# EAGLE schematic omni-usb_1.00a (EAGLE 6.6.0)

## Sheet 1 of 3
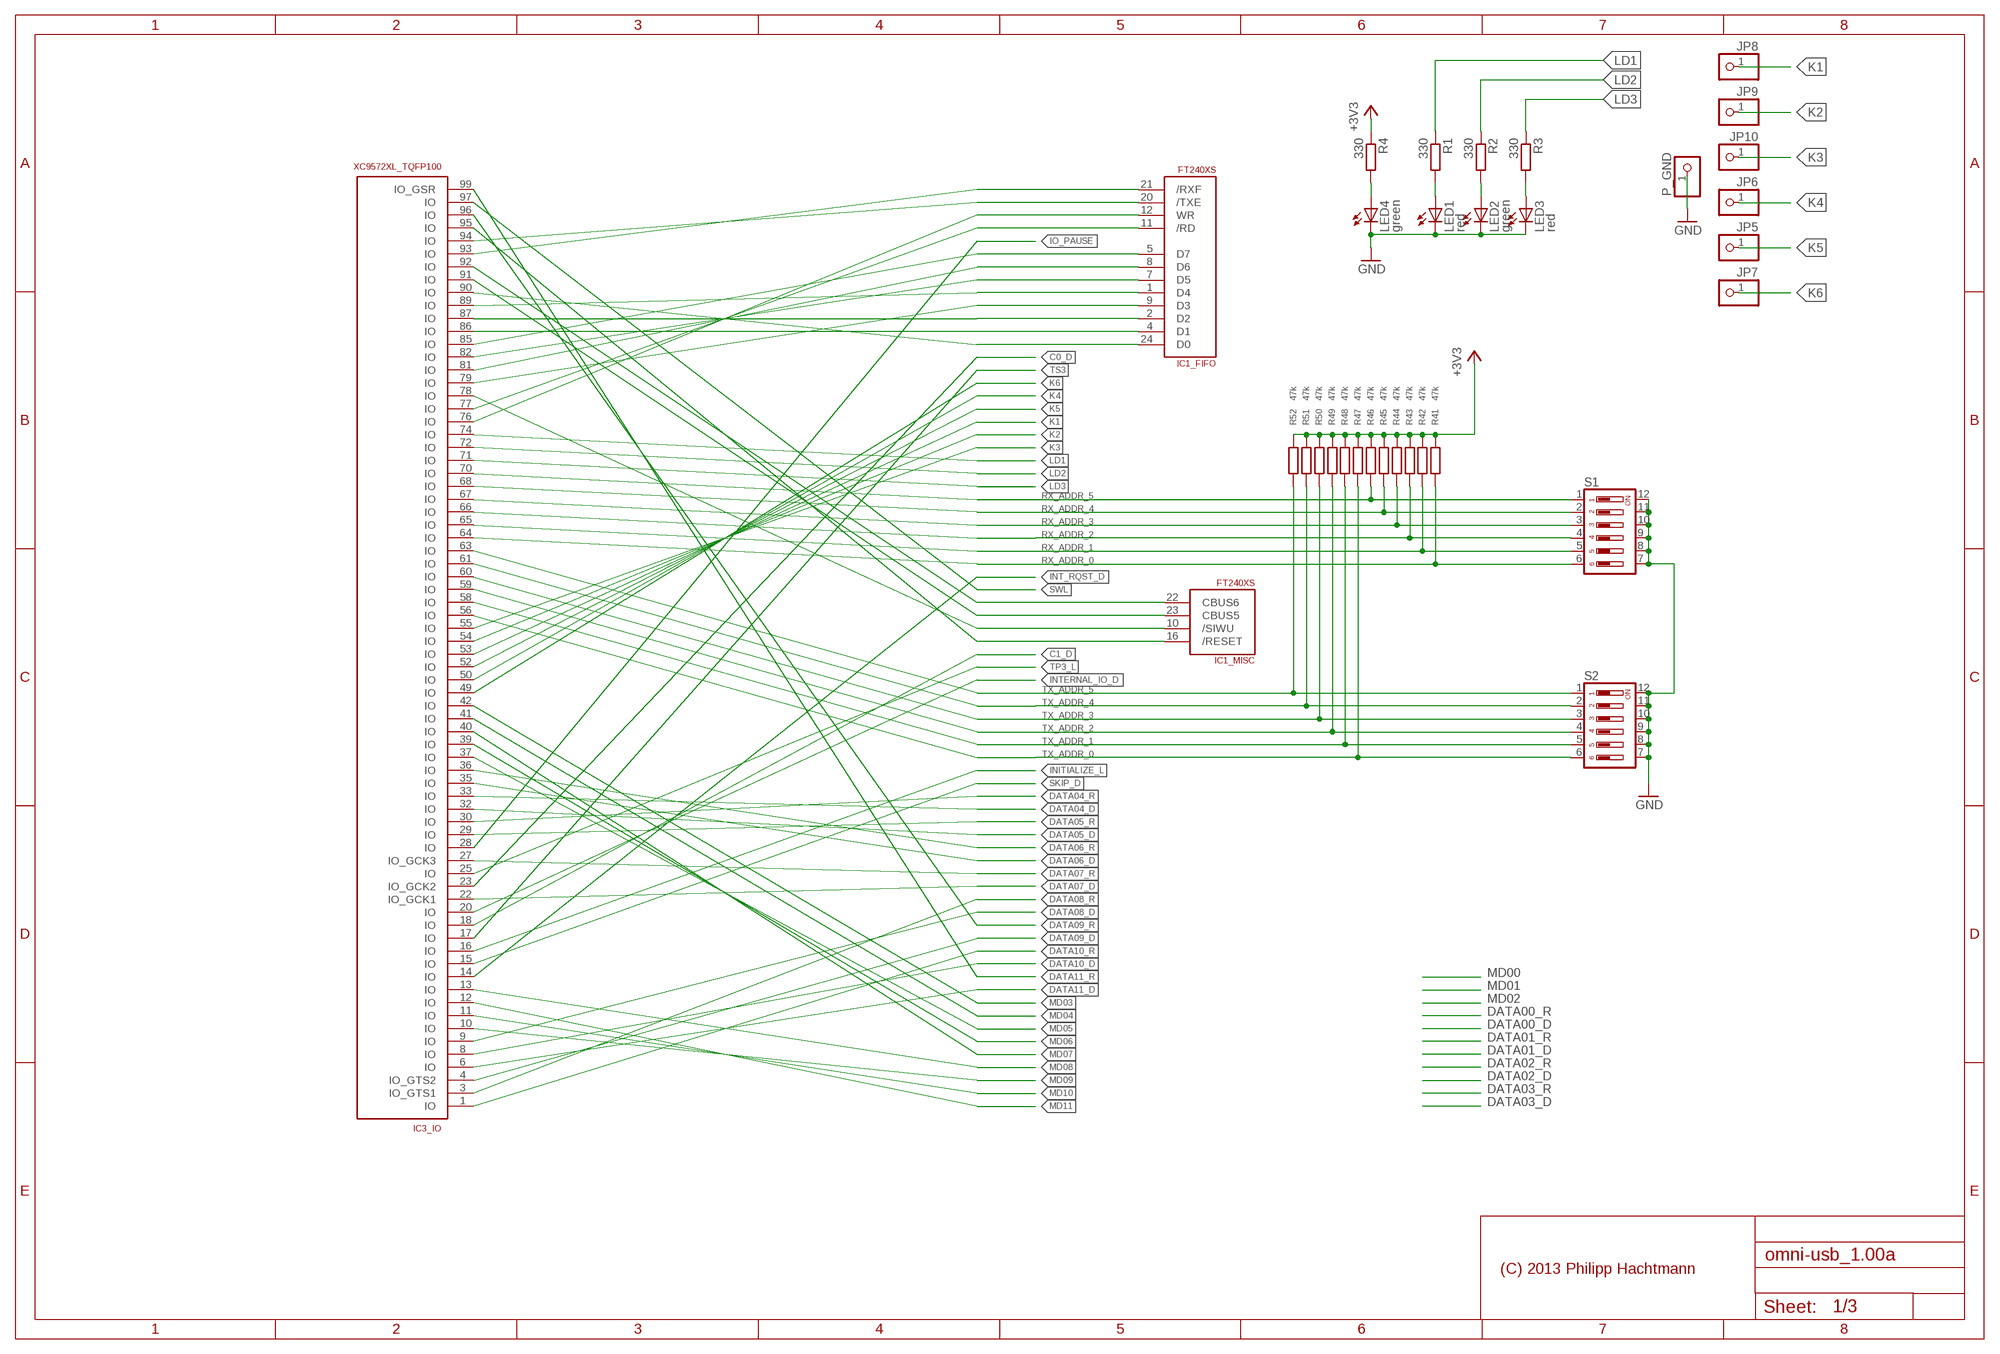
[diagram p0: schematic, sheet 1]

### Parts
IC1  FT240XS  [TSSOP24]
IC3  XC9572XL_TQFP100  [TQ100]
JP5  PINHD-1X1  [1X01]
JP6  PINHD-1X1  [1X01]
JP7  PINHD-1X1  [1X01]
JP8  PINHD-1X1  [1X01]
JP9  PINHD-1X1  [1X01]
JP10  PINHD-1X1  [1X01]
LED1  red  LEDCHIPLED_0805  [CHIPLED_0805]
LED2  green  LEDCHIPLED_0805  [CHIPLED_0805]
LED3  red  LEDCHIPLED_0805  [CHIPLED_0805]
LED4  green  LEDCHIPLED_0805  [CHIPLED_0805]
P_GND  PINHD-1X1  [1X01]
R1  330  R-EU_R0805  [R0805]
R2  330  R-EU_R0805  [R0805]
R3  330  R-EU_R0805  [R0805]
R4  330  R-EU_R0805  [R0805]
R41  47k  R-EU_R0805  [R0805]
R42  47k  R-EU_R0805  [R0805]
R43  47k  R-EU_R0805  [R0805]
R44  47k  R-EU_R0805  [R0805]
R45  47k  R-EU_R0805  [R0805]
R46  47k  R-EU_R0805  [R0805]
R47  47k  R-EU_R0805  [R0805]
R48  47k  R-EU_R0805  [R0805]
R49  47k  R-EU_R0805  [R0805]
R50  47k  R-EU_R0805  [R0805]
R51  47k  R-EU_R0805  [R0805]
R52  47k  R-EU_R0805  [R0805]
S1  DIP06YL  [DIP06YL]
S2  DIP06YL  [DIP06YL]

### Nets
!RD: IC1.11(_FIFO:/RD) IC3.77(_IO:IO)
!RESET: IC1.16(_MISC:/RESET) IC3.95(_IO:IO)
!RXF: IC1.21(_FIFO:/RXF) IC3.93(_IO:IO)
!TXE: IC1.20(_FIFO:/TXE) IC3.94(_IO:IO)
+3V3: R4.1 R41.2 R42.2 R43.2 R44.2 R45.2 R46.2 R47.2 R48.2 R49.2 R50.2 R51.2 R52.2 ; also sheet 3
/SIWU: IC1.10(_MISC:/SIWU) IC3.78(_IO:IO)
C0_D: IC3.23(_IO:IO_GCK2) ; also sheet 2
C1_D: IC3.18(_IO:IO) ; also sheet 2
CBUS5: IC1.23(_MISC:CBUS5) IC3.91(_IO:IO)
CBUS6: IC1.22(_MISC:CBUS6) IC3.92(_IO:IO)
D0: IC1.24(_FIFO:D0) IC3.90(_IO:IO)
D1: IC1.4(_FIFO:D1) IC3.86(_IO:IO)
D2: IC1.2(_FIFO:D2) IC3.87(_IO:IO)
D3: IC1.9(_FIFO:D3) IC3.79(_IO:IO)
D4: IC1.1(_FIFO:D4) IC3.89(_IO:IO)
D5: IC1.7(_FIFO:D5) IC3.82(_IO:IO)
D6: IC1.8(_FIFO:D6) IC3.81(_IO:IO)
D7: IC1.5(_FIFO:D7) IC3.85(_IO:IO)
DATA04_D: IC3.33(_IO:IO) ; also sheet 2
DATA04_R: IC3.30(_IO:IO) ; also sheet 2,3
DATA05_D: IC3.32(_IO:IO) ; also sheet 2
DATA05_R: IC3.29(_IO:IO) ; also sheet 2,3
DATA06_D: IC3.35(_IO:IO) ; also sheet 2
DATA06_R: IC3.36(_IO:IO) ; also sheet 2,3
DATA07_D: IC3.22(_IO:IO_GCK1) ; also sheet 2
DATA07_R: IC3.27(_IO:IO_GCK3) ; also sheet 2,3
DATA08_D: IC3.9(_IO:IO) ; also sheet 2
DATA08_R: IC3.3(_IO:IO_GTS1) ; also sheet 2,3
DATA09_D: IC3.4(_IO:IO_GTS2) ; also sheet 2
DATA09_R: IC3.96(_IO:IO) ; also sheet 2,3
DATA10_D: IC3.8(_IO:IO) ; also sheet 2
DATA10_R: IC3.1(_IO:IO) ; also sheet 2,3
DATA11_D: IC3.6(_IO:IO) ; also sheet 2
DATA11_R: IC3.99(_IO:IO_GSR) ; also sheet 2,3
GND: LED1.C LED2.C LED3.C LED4.C P_GND.1 S1.7 S1.8 S1.9 S1.10 S1.11 S1.12 S2.7 S2.8 S2.9 S2.10 S2.11 S2.12 ; also sheet 3
INITIALIZE_L: IC3.16(_IO:IO) ; also sheet 2,3
INT_RQST_D: IC3.14(_IO:IO) ; also sheet 2
INTERNAL_IO_D: IC3.20(_IO:IO) ; also sheet 2
IO_PAUSE: IC3.28(_IO:IO) ; also sheet 2,3
K1: IC3.53(_IO:IO) JP8.1
K2: IC3.54(_IO:IO) JP9.1
K3: IC3.55(_IO:IO) JP10.1
K4: IC3.50(_IO:IO) JP6.1
K5: IC3.52(_IO:IO) JP5.1
K6: IC3.49(_IO:IO) JP7.1
LD1: IC3.74(_IO:IO) R1.1
LD2: IC3.72(_IO:IO) R2.1
LD3: IC3.71(_IO:IO) R3.1
LED3: LED2.A R2.2
MD03: IC3.42(_IO:IO) ; also sheet 2,3
MD04: IC3.41(_IO:IO) ; also sheet 2,3
MD05: IC3.37(_IO:IO) ; also sheet 2,3
MD06: IC3.39(_IO:IO) ; also sheet 2,3
MD07: IC3.40(_IO:IO) ; also sheet 2,3
MD08: IC3.13(_IO:IO) ; also sheet 2,3
MD09: IC3.10(_IO:IO) ; also sheet 2,3
MD10: IC3.11(_IO:IO) ; also sheet 2,3
MD11: IC3.12(_IO:IO) ; also sheet 2,3
N$7: IC1.12(_FIFO:WR) IC3.76(_IO:IO)
N$21: LED1.A R1.2
N$33: LED4.A R4.2
N$37: LED3.A R3.2
RX_ADDR_0: IC3.64(_IO:IO) R41.1 S1.6
RX_ADDR_1: IC3.65(_IO:IO) R42.1 S1.5
RX_ADDR_2: IC3.66(_IO:IO) R43.1 S1.4
RX_ADDR_3: IC3.67(_IO:IO) R44.1 S1.3
RX_ADDR_4: IC3.68(_IO:IO) R45.1 S1.2
RX_ADDR_5: IC3.70(_IO:IO) R46.1 S1.1
SKIP_D: IC3.15(_IO:IO) ; also sheet 2
SWL: IC3.97(_IO:IO) ; also sheet 2,3
TP3_L: IC3.25(_IO:IO) ; also sheet 2,3
TS3: IC3.17(_IO:IO) ; also sheet 2,3
TX_ADDR_0: IC3.56(_IO:IO) R47.1 S2.6
TX_ADDR_1: IC3.58(_IO:IO) R48.1 S2.5
TX_ADDR_2: IC3.59(_IO:IO) R49.1 S2.4
TX_ADDR_3: IC3.60(_IO:IO) R50.1 S2.3
TX_ADDR_4: IC3.61(_IO:IO) R51.1 S2.2
TX_ADDR_5: IC3.63(_IO:IO) R52.1 S2.1
Unconnected: IC3.2(_NC:NC) IC3.7(_NC:NC) IC3.19(_NC:NC) IC3.24(_NC:NC) IC3.34(_NC:NC) IC3.43(_NC:NC) IC3.46(_NC:NC) IC3.73(_NC:NC) IC3.80(_NC:NC)

## Sheet 2 of 3
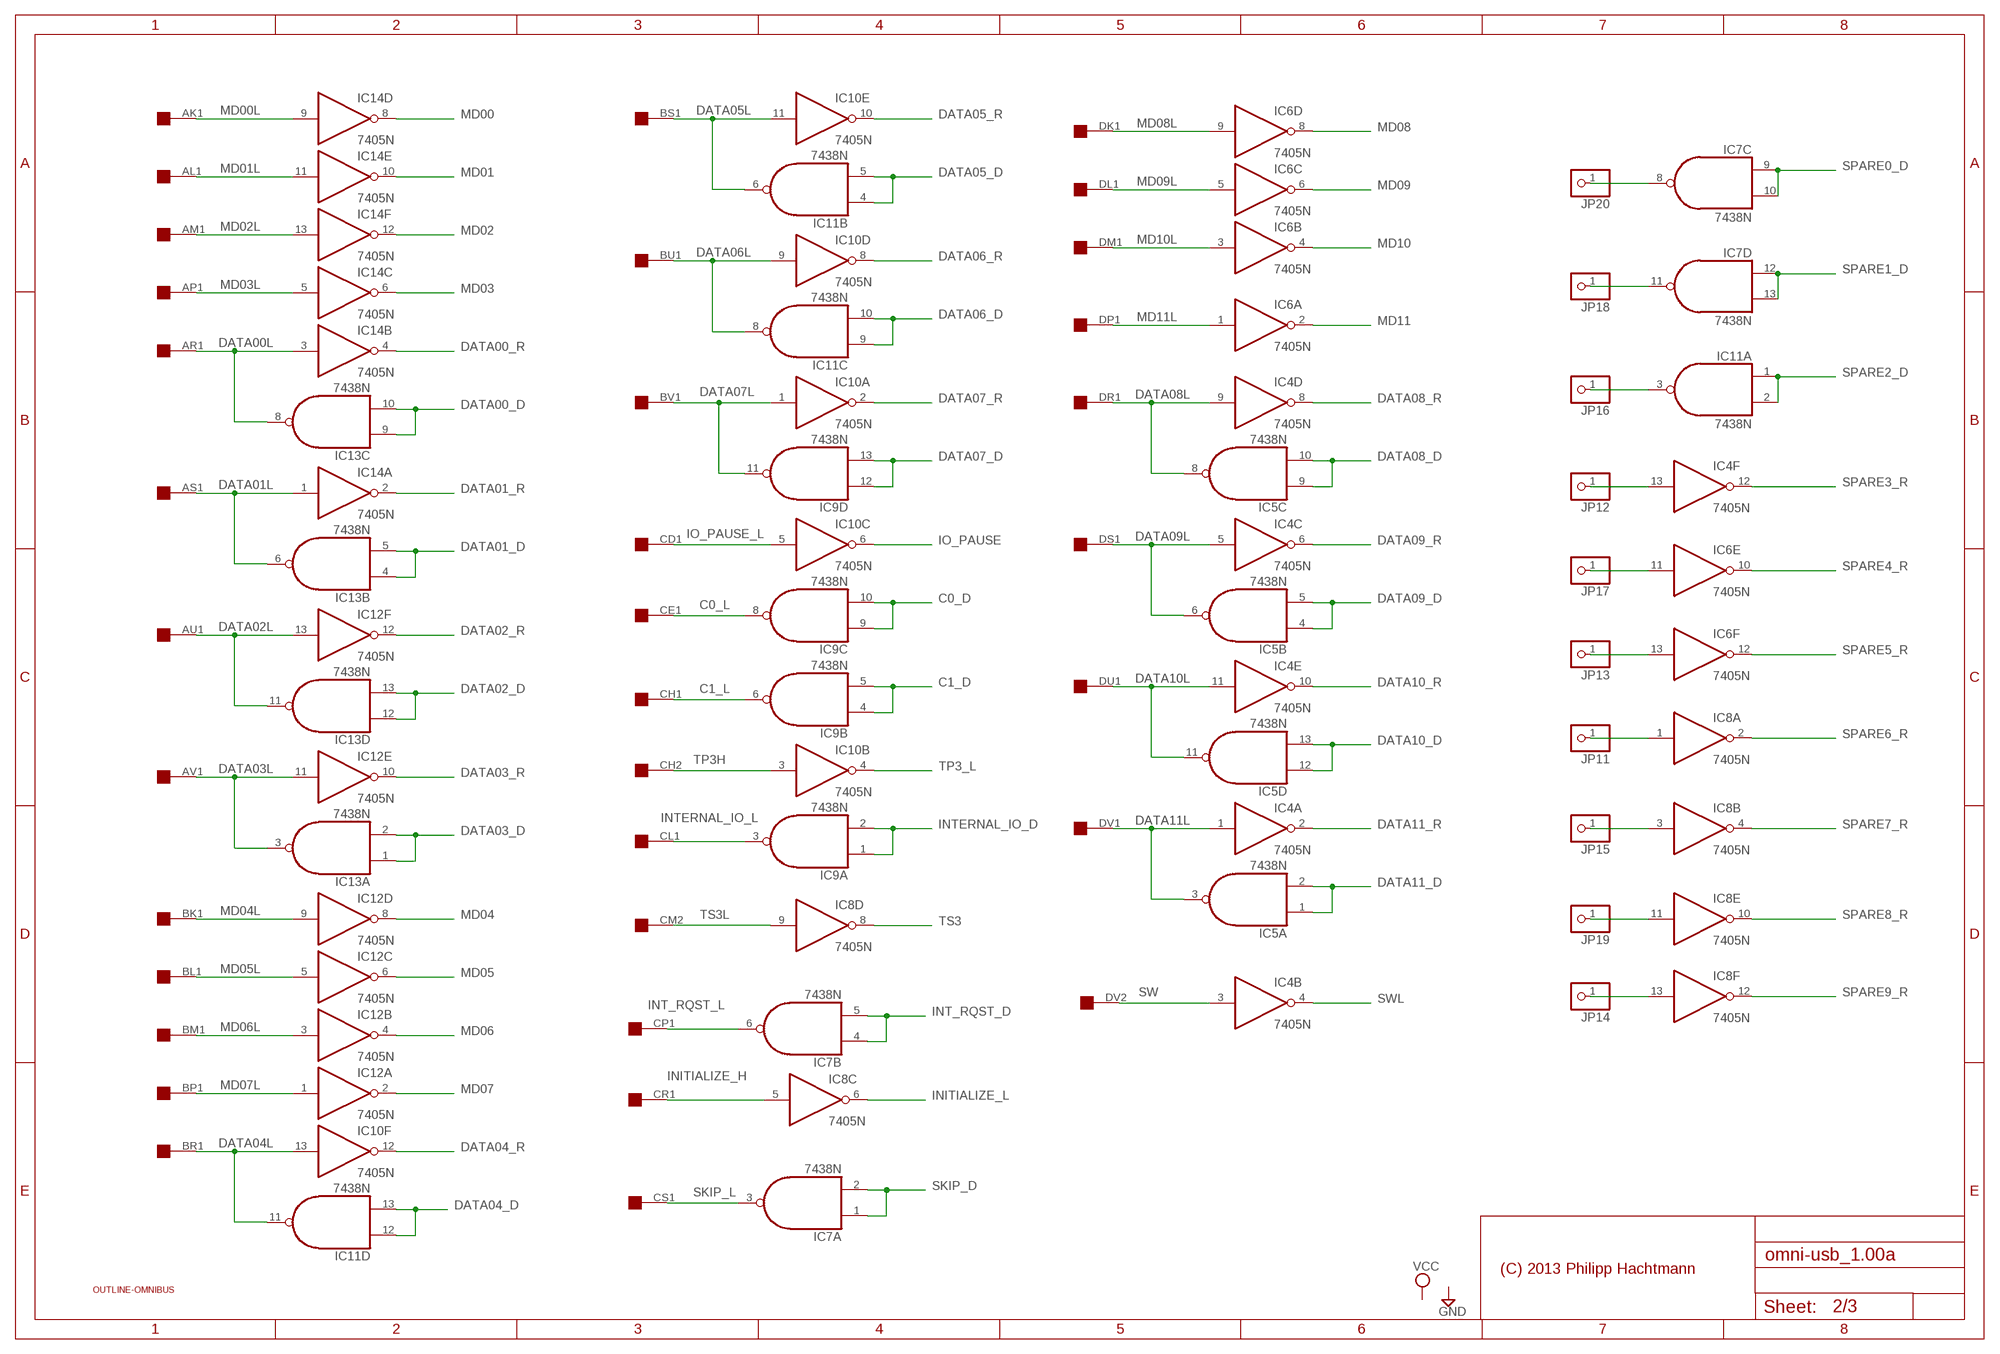
[diagram p1: schematic, sheet 2]

### Parts
IC4  7405N  [DIL14]
IC5  7438N  [DIL14]
IC6  7405N  [DIL14]
IC7  7438N  [DIL14]
IC8  7405N  [DIL14]
IC9  7438N  [DIL14]
IC10  7405N  [DIL14]
IC11  7438N  [DIL14]
IC12  7405N  [DIL14]
IC13  7438N  [DIL14]
IC14  7405N  [DIL14]
JP11  PINHD-1X1  [1X01]
JP12  PINHD-1X1  [1X01]
JP13  PINHD-1X1  [1X01]
JP14  PINHD-1X1  [1X01]
JP15  PINHD-1X1  [1X01]
JP16  PINHD-1X1  [1X01]
JP17  PINHD-1X1  [1X01]
JP18  PINHD-1X1  [1X01]
JP19  PINHD-1X1  [1X01]
JP20  PINHD-1X1  [1X01]
U$1  OUTLINE-OMNIBUS  [OMNIBUS]
U$2  QUAD  [EDGE-CON8]

### Nets
C0_D: IC9.9(C:I0) IC9.10(C:I1) ; also sheet 1
C0_L: IC9.8(C:O) U$2.CE1
C1_D: IC9.4(B:I0) IC9.5(B:I1) ; also sheet 1
C1_L: IC9.6(B:O) U$2.CH1
DATA00_D: IC13.9(C:I0) IC13.10(C:I1) ; also sheet 1
DATA00_R: IC14.4(B:O) ; also sheet 1,3
DATA00L: IC13.8(C:O) IC14.3(B:I) U$2.AR1
DATA01_D: IC13.4(B:I0) IC13.5(B:I1) ; also sheet 1
DATA01_R: IC14.2(A:O) ; also sheet 1,3
DATA01L: IC13.6(B:O) IC14.1(A:I) U$2.AS1
DATA02_D: IC13.12(D:I0) IC13.13(D:I1) ; also sheet 1
DATA02_R: IC12.12(F:O) ; also sheet 1,3
DATA02L: IC12.13(F:I) IC13.11(D:O) U$2.AU1
DATA03_D: IC13.1(A:I0) IC13.2(A:I1) ; also sheet 1
DATA03_R: IC12.10(E:O) ; also sheet 1,3
DATA03L: IC12.11(E:I) IC13.3(A:O) U$2.AV1
DATA04_D: IC11.12(D:I0) IC11.13(D:I1) ; also sheet 1
DATA04_R: IC10.12(F:O) ; also sheet 1,3
DATA04L: IC10.13(F:I) IC11.11(D:O) U$2.BR1
DATA05_D: IC11.4(B:I0) IC11.5(B:I1) ; also sheet 1
DATA05_R: IC10.10(E:O) ; also sheet 1,3
DATA05L: IC10.11(E:I) IC11.6(B:O) U$2.BS1
DATA06_D: IC11.9(C:I0) IC11.10(C:I1) ; also sheet 1
DATA06_R: IC10.8(D:O) ; also sheet 1,3
DATA06L: IC10.9(D:I) IC11.8(C:O) U$2.BU1
DATA07_D: IC9.12(D:I0) IC9.13(D:I1) ; also sheet 1
DATA07_R: IC10.2(A:O) ; also sheet 1,3
DATA07L: IC9.11(D:O) IC10.1(A:I) U$2.BV1
DATA08_D: IC5.9(C:I0) IC5.10(C:I1) ; also sheet 1
DATA08_R: IC4.8(D:O) ; also sheet 1,3
DATA08L: IC4.9(D:I) IC5.8(C:O) U$2.DR1
DATA09_D: IC5.4(B:I0) IC5.5(B:I1) ; also sheet 1
DATA09_R: IC4.6(C:O) ; also sheet 1,3
DATA09L: IC4.5(C:I) IC5.6(B:O) U$2.DS1
DATA10_D: IC5.12(D:I0) IC5.13(D:I1) ; also sheet 1
DATA10_R: IC4.10(E:O) ; also sheet 1,3
DATA10L: IC4.11(E:I) IC5.11(D:O) U$2.DU1
DATA11_D: IC5.1(A:I0) IC5.2(A:I1) ; also sheet 1
DATA11_R: IC4.2(A:O) ; also sheet 1,3
DATA11L: IC4.1(A:I) IC5.3(A:O) U$2.DV1
INITIALIZE_H: IC8.5(C:I) U$2.CR1
INITIALIZE_L: IC8.6(C:O) ; also sheet 1,3
INT_RQST_D: IC7.4(B:I0) IC7.5(B:I1) ; also sheet 1
INT_RQST_L: IC7.6(B:O) U$2.CP1
INTERNAL_IO_D: IC9.1(A:I0) IC9.2(A:I1) ; also sheet 1
INTERNAL_IO_L: IC9.3(A:O) U$2.CL1
IO_PAUSE: IC10.6(C:O) ; also sheet 1,3
IO_PAUSE_L: IC10.5(C:I) U$2.CD1
MD00: IC14.8(D:O) ; also sheet 1,3
MD00L: IC14.9(D:I) U$2.AK1
MD01: IC14.10(E:O) ; also sheet 1,3
MD01L: IC14.11(E:I) U$2.AL1
MD02: IC14.12(F:O) ; also sheet 1,3
MD02L: IC14.13(F:I) U$2.AM1
MD03: IC14.6(C:O) ; also sheet 1,3
MD03L: IC14.5(C:I) U$2.AP1
MD04: IC12.8(D:O) ; also sheet 1,3
MD04L: IC12.9(D:I) U$2.BK1
MD05: IC12.6(C:O) ; also sheet 1,3
MD05L: IC12.5(C:I) U$2.BL1
MD06: IC12.4(B:O) ; also sheet 1,3
MD06L: IC12.3(B:I) U$2.BM1
MD07: IC12.2(A:O) ; also sheet 1,3
MD07L: IC12.1(A:I) U$2.BP1
MD08: IC6.8(D:O) ; also sheet 1,3
MD08L: IC6.9(D:I) U$2.DK1
MD09: IC6.6(C:O) ; also sheet 1,3
MD09L: IC6.5(C:I) U$2.DL1
MD10: IC6.4(B:O) ; also sheet 1,3
MD10L: IC6.3(B:I) U$2.DM1
MD11: IC6.2(A:O) ; also sheet 1,3
MD11L: IC6.1(A:I) U$2.DP1
N$1: IC7.8(C:O) JP20.1
N$10: IC7.11(D:O) JP18.1
N$11: IC11.3(A:O) JP16.1
N$13: IC4.13(F:I) JP12.1
N$14: IC6.11(E:I) JP17.1
N$15: IC6.13(F:I) JP13.1
N$18: IC8.1(A:I) JP11.1
N$19: IC8.3(B:I) JP15.1
N$20: IC8.11(E:I) JP19.1
N$22: IC8.13(F:I) JP14.1
SKIP_D: IC7.1(A:I0) IC7.2(A:I1) ; also sheet 1
SKIP_L: IC7.3(A:O) U$2.CS1
SPARE0_D: IC7.9(C:I0) IC7.10(C:I1)
SPARE1_D: IC7.12(D:I0) IC7.13(D:I1)
SPARE2_D: IC11.1(A:I0) IC11.2(A:I1)
SPARE3_R: IC4.12(F:O) ; also sheet 3
SPARE4_R: IC6.10(E:O) ; also sheet 3
SPARE5_R: IC6.12(F:O) ; also sheet 3
SPARE6_R: IC8.2(A:O) ; also sheet 3
SPARE7_R: IC8.4(B:O) ; also sheet 3
SPARE8_R: IC8.10(E:O) ; also sheet 3
SPARE9_R: IC8.12(F:O) ; also sheet 3
SW: IC4.3(B:I) U$2.DV2
SWL: IC4.4(B:O) ; also sheet 1,3
TP3_L: IC10.4(B:O) ; also sheet 1,3
TP3H: IC10.3(B:I) U$2.CH2
TS3: IC8.8(D:O) ; also sheet 1,3
TS3L: IC8.9(D:I) U$2.CM2
Unconnected: U$2.AA1 U$2.AB1 U$2.AB2 U$2.AC1 U$2.AD1 U$2.AD2 U$2.AE1 U$2.AE2 U$2.AH1 U$2.AH2 U$2.AJ1 U$2.AJ2 U$2.AK2 U$2.AL2 U$2.AM2 U$2.AP2 U$2.AR2 U$2.AS2 U$2.AU2 U$2.AV2 U$2.BA1 U$2.BB1 U$2.BB2 U$2.BD1 U$2.BD2 U$2.BE1 U$2.BE2 U$2.BH1 U$2.BH2 U$2.BJ1 U$2.BJ2 U$2.BK2 U$2.BL2 U$2.BM2 U$2.BP2 U$2.BR2 U$2.BS2 U$2.BU2 U$2.BV2 U$2.CA1 U$2.CB1 U$2.CB2 U$2.CD2 U$2.CE2 U$2.CJ1 U$2.CJ2 U$2.CK1 U$2.CK2 U$2.CL2 U$2.CM1 U$2.CP2 U$2.CR2 U$2.CS2 U$2.CU1 U$2.CU2 U$2.CV1 U$2.CV2 U$2.DA1 U$2.DA2 U$2.DB1 U$2.DB2 U$2.DD1 U$2.DD2 U$2.DE1 U$2.DE2 U$2.DH1 U$2.DH2 U$2.DJ1 U$2.DJ2 U$2.DK2 U$2.DL2 U$2.DM2 U$2.DP2 U$2.DR2 U$2.DS2 U$2.DU2

## Sheet 3 of 3
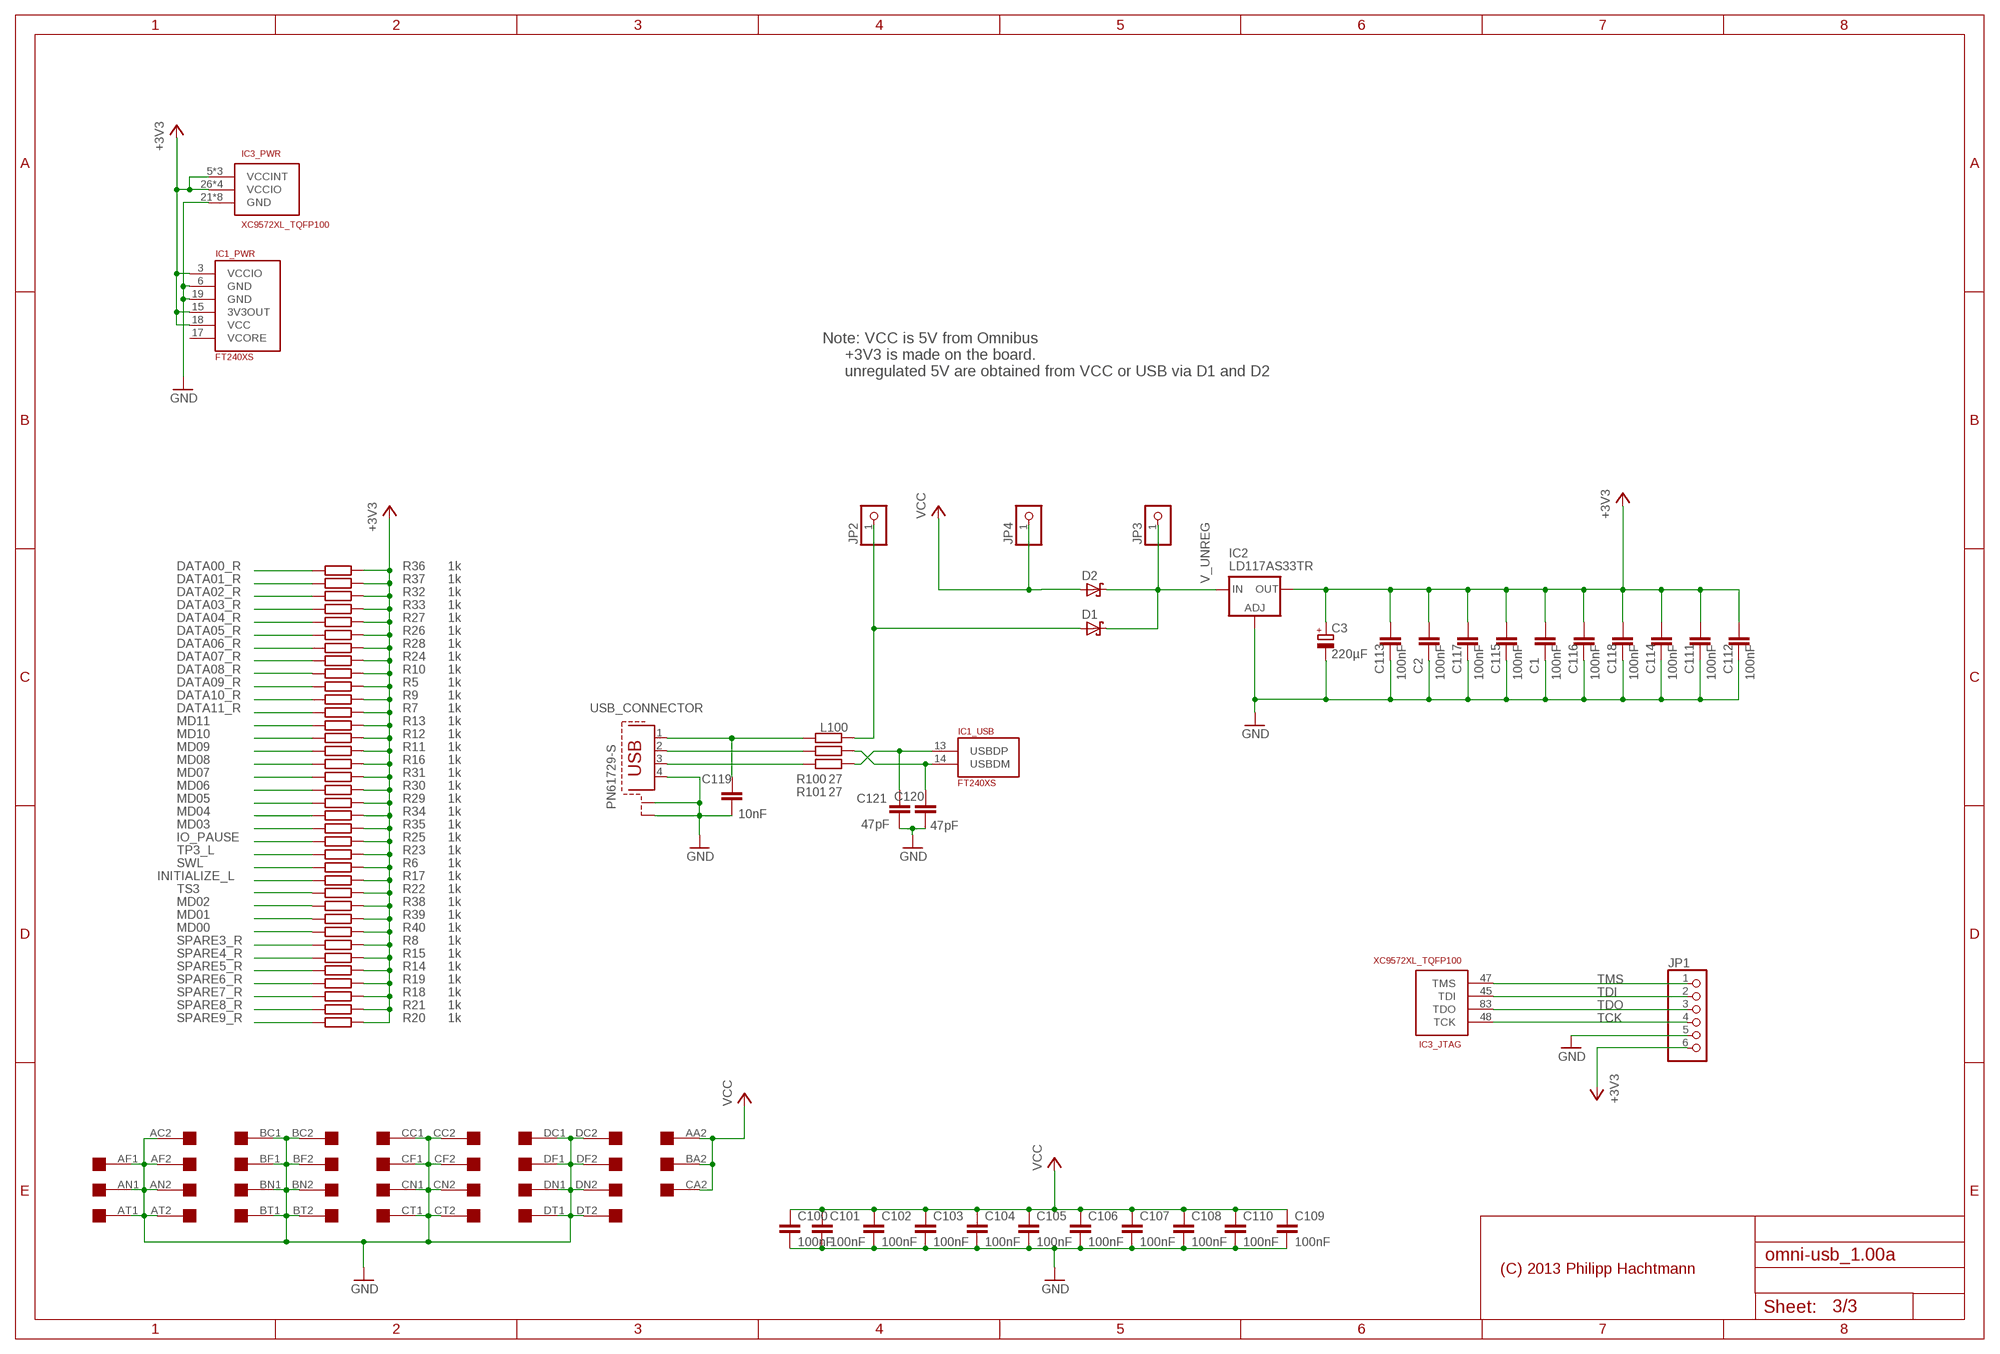
[diagram p2: schematic, sheet 3]

### Parts
C1  100nF  C-EUC0805  [C0805]
C2  100nF  C-EUC0805  [C0805]
C3  220µF  CPOL-EUSANYO_SMD_F8  [SANYO-OSCON_SMD_F8]
C100  100nF  C-EUC0805  [C0805]
C101  100nF  C-EUC0805  [C0805]
C102  100nF  C-EUC0805  [C0805]
C103  100nF  C-EUC0805  [C0805]
C104  100nF  C-EUC0805  [C0805]
C105  100nF  C-EUC0805  [C0805]
C106  100nF  C-EUC0805  [C0805]
C107  100nF  C-EUC0805  [C0805]
C108  100nF  C-EUC0805  [C0805]
C109  100nF  C-EUC0805  [C0805]
C110  100nF  C-EUC0805  [C0805]
C111  100nF  C-EUC0805  [C0805]
C112  100nF  C-EUC0805  [C0805]
C113  100nF  C-EUC0805  [C0805]
C114  100nF  C-EUC0805  [C0805]
C115  100nF  C-EUC0805  [C0805]
C116  100nF  C-EUC0805  [C0805]
C117  100nF  C-EUC0805  [C0805]
C118  100nF  C-EUC0805  [C0805]
C119  10nF  C-EUC0805  [C0805]
C120  47pF  C-EUC0805  [C0805]
C121  47pF  C-EUC0805  [C0805]
D1  SCHOTTKY-DIODESMD  [SMB]
D2  SCHOTTKY-DIODESMD  [SMB]
IC2  LD117AS33TR  [SOT223]
JP1  PINHD-1X6/90  [1X06/90]
JP2  PINHD-1X1  [1X01]
JP3  PINHD-1X1  [1X01]
JP4  PINHD-1X1  [1X01]
L100  R-EU_R0805  [R0805]
R5  1k  R-EU_R0805  [R0805]
R6  1k  R-EU_R0805  [R0805]
R7  1k  R-EU_R0805  [R0805]
R8  1k  R-EU_R0805  [R0805]
R9  1k  R-EU_R0805  [R0805]
R10  1k  R-EU_R0805  [R0805]
R11  1k  R-EU_R0805  [R0805]
R12  1k  R-EU_R0805  [R0805]
R13  1k  R-EU_R0805  [R0805]
R14  1k  R-EU_R0805  [R0805]
R15  1k  R-EU_R0805  [R0805]
R16  1k  R-EU_R0805  [R0805]
R17  1k  R-EU_R0805  [R0805]
R18  1k  R-EU_R0805  [R0805]
R19  1k  R-EU_R0805  [R0805]
R20  1k  R-EU_R0805  [R0805]
R21  1k  R-EU_R0805  [R0805]
R22  1k  R-EU_R0805  [R0805]
R23  1k  R-EU_R0805  [R0805]
R24  1k  R-EU_R0805  [R0805]
R25  1k  R-EU_R0805  [R0805]
R26  1k  R-EU_R0805  [R0805]
R27  1k  R-EU_R0805  [R0805]
R28  1k  R-EU_R0805  [R0805]
R29  1k  R-EU_R0805  [R0805]
R30  1k  R-EU_R0805  [R0805]
R31  1k  R-EU_R0805  [R0805]
R32  1k  R-EU_R0805  [R0805]
R33  1k  R-EU_R0805  [R0805]
R34  1k  R-EU_R0805  [R0805]
R35  1k  R-EU_R0805  [R0805]
R36  1k  R-EU_R0805  [R0805]
R37  1k  R-EU_R0805  [R0805]
R38  1k  R-EU_R0805  [R0805]
R39  1k  R-EU_R0805  [R0805]
R40  1k  R-EU_R0805  [R0805]
R100  27  R-EU_R0805  [R0805]
R101  27  R-EU_R0805  [R0805]
USB_CONNECTOR  PN61729-S  [PN61729-S]

### Nets
+3V3: C1.1 C2.1 C3.+ C111.1 C112.1 C113.1 C114.1 C115.1 C116.1 C117.1 C118.1 IC1.3(_PWR:VCCIO) IC1.15(_PWR:3V3OUT) IC1.18(_PWR:VCC) IC2.4(OUT) IC3.5(_PWR:VCCINT) IC3.26(_PWR:VCCIO) IC3.38(_PWR:VCCIO) IC3.51(_PWR:VCCIO) IC3.57(_PWR:VCCINT) IC3.88(_PWR:VCCIO) IC3.98(_PWR:VCCINT) JP1.6 R5.1 R6.1 R7.1 R8.1 R9.1 R10.1 R11.1 R12.1 R13.1 R14.1 R15.1 R16.1 R17.1 R18.1 R19.1 R20.1 R21.1 R22.1 R23.1 R24.1 R25.1 R26.1 R27.1 R28.1 R29.1 R30.1 R31.1 R32.1 R33.1 R34.1 R35.1 R36.1 R37.1 R38.1 R39.1 R40.1 ; also sheet 1
DATA00_R: R36.2 ; also sheet 1,2
DATA01_R: R37.2 ; also sheet 1,2
DATA02_R: R32.2 ; also sheet 1,2
DATA03_R: R33.2 ; also sheet 1,2
DATA04_R: R27.2 ; also sheet 1,2
DATA05_R: R26.2 ; also sheet 1,2
DATA06_R: R28.2 ; also sheet 1,2
DATA07_R: R24.2 ; also sheet 1,2
DATA08_R: R10.2 ; also sheet 1,2
DATA09_R: R5.2 ; also sheet 1,2
DATA10_R: R9.2 ; also sheet 1,2
DATA11_R: R7.2 ; also sheet 1,2
GND: C1.2 C2.2 C3.- C100.2 C101.2 C102.2 C103.2 C104.2 C105.2 C106.2 C107.2 C108.2 C109.2 C110.2 C111.2 C112.2 C113.2 C114.2 C115.2 C116.2 C117.2 C118.2 C119.2 C120.2 C121.2 IC1.6(_PWR:GND) IC1.19(_PWR:GND) IC2.1(ADJ) IC3.21(_PWR:GND) IC3.31(_PWR:GND) IC3.44(_PWR:GND) IC3.62(_PWR:GND) IC3.69(_PWR:GND) IC3.75(_PWR:GND) IC3.84(_PWR:GND) IC3.100(_PWR:GND) JP1.5 U$2.AC2 U$2.AF1 U$2.AF2 U$2.AN1 U$2.AN2 U$2.AT1 U$2.AT2 U$2.BC1 U$2.BC2 U$2.BF1 U$2.BF2 U$2.BN1 U$2.BN2 U$2.BT1 U$2.BT2 U$2.CC1 U$2.CC2 U$2.CF1 U$2.CF2 U$2.CN1 U$2.CN2 U$2.CT1 U$2.CT2 U$2.DC1 U$2.DC2 U$2.DF1 U$2.DF2 U$2.DN1 U$2.DN2 U$2.DT1 U$2.DT2 USB_CONNECTOR.4 USB_CONNECTOR.S1 USB_CONNECTOR.S2 ; also sheet 1
INITIALIZE_L: R17.2 ; also sheet 1,2
IO_PAUSE: R25.2 ; also sheet 1,2
MD00: R40.2 ; also sheet 1,2
MD01: R39.2 ; also sheet 1,2
MD02: R38.2 ; also sheet 1,2
MD03: R35.2 ; also sheet 1,2
MD04: R34.2 ; also sheet 1,2
MD05: R29.2 ; also sheet 1,2
MD06: R30.2 ; also sheet 1,2
MD07: R31.2 ; also sheet 1,2
MD08: R16.2 ; also sheet 1,2
MD09: R11.2 ; also sheet 1,2
MD10: R12.2 ; also sheet 1,2
MD11: R13.2 ; also sheet 1,2
N$2: C121.1 IC1.13(_USB:USBDP) R101.2
N$3: C119.1 L100.2 USB_CONNECTOR.1
N$12: C120.1 IC1.14(_USB:USBDM) R100.2
N$16: R100.1 USB_CONNECTOR.2
N$17: R101.1 USB_CONNECTOR.3
SPARE3_R: R8.2 ; also sheet 2
SPARE4_R: R15.2 ; also sheet 2
SPARE5_R: R14.2 ; also sheet 2
SPARE6_R: R19.2 ; also sheet 2
SPARE7_R: R18.2 ; also sheet 2
SPARE8_R: R21.2 ; also sheet 2
SPARE9_R: R20.2 ; also sheet 2
SWL: R6.2 ; also sheet 1,2
TCK: IC3.48(_JTAG:TCK) JP1.4
TDI: IC3.45(_JTAG:TDI) JP1.2
TDO: IC3.83(_JTAG:TDO) JP1.3
TMS: IC3.47(_JTAG:TMS) JP1.1
TP3_L: R23.2 ; also sheet 1,2
TS3: R22.2 ; also sheet 1,2
V_UNREG: D1.C D2.C IC2.3(IN) JP3.1
V_USB: D1.A JP2.1 L100.1
VCC: C100.1 C101.1 C102.1 C103.1 C104.1 C105.1 C106.1 C107.1 C108.1 C109.1 C110.1 D2.A JP4.1 U$2.AA2 U$2.BA2 U$2.CA2
Unconnected: IC1.17(_PWR:VCORE)

### Notes on the sheet
- Note: VCC is 5V from Omnibus
       +3V3 is made on the board.
       unregulated 5V are obtained from VCC or USB via D1 and D2

## Power pins joined to a net without a drawn wire
GND: IC4.7(P:GND) IC5.7(P:GND) IC6.7(P:GND) IC7.7(P:GND) IC8.7(P:GND) IC9.7(P:GND) IC10.7(P:GND) IC11.7(P:GND) IC12.7(P:GND) IC13.7(P:GND) IC14.7(P:GND)
VCC: IC4.14(P:VCC) IC5.14(P:VCC) IC6.14(P:VCC) IC7.14(P:VCC) IC8.14(P:VCC) IC9.14(P:VCC) IC10.14(P:VCC) IC11.14(P:VCC) IC12.14(P:VCC) IC13.14(P:VCC) IC14.14(P:VCC)

## Library data of the parts
C1 C2 C100-C118 = rcl:C-EU: CAPACITOR, European symbol; MF: AVX; MPN: 08053C104KAT2A; OC_FARNELL: 1740665
C3 = rcl:CPOL-EU: POLARIZED CAPACITOR, European symbol; MF: MULTICOMP; MPN: MCEEL10V227M8X10.5; OC_FARNELL: 9265546
C119 = rcl:C-EU: CAPACITOR, European symbol; MF: AVX; MPN: 08055C103KAT2A; OC_FARNELL: 499225
C120 C121 = rcl:C-EU: CAPACITOR, European symbol; MF: MULTICOMP; MPN: MCCA000326; OC_FARNELL: 1759199
D1 D2 = diode:SCHOTTKY-DIODE: Schottky Diode; MF: INFINEON; MPN: BAT165; OC_FARNELL: 1056502
IC1 = ftdi:FT240X; MF: FTDI; MPN: FT240XS; OC_FARNELL: 2081332
IC2 = v-reg:LD117A?*: Low drop fixed and adjustable positive voltage regulators 1 A Source: http://www.st.com/stonline/products/literature/ds/7194/ld1117axx.pdf; MF: TEXAS INSTRUMENTS; MPN: TLV1117-33CDCY; OC_FARNELL: 1494942
IC3 = xilinxx:XC9572XL_TQFP100; MF: XILINX; MPN: XC9572XL-10TQG100C; OC_FARNELL: 1193233
IC4 IC6 IC8 IC10 IC12 IC14 = 74xx-us:74*05: Hex INVERTER, open collector; MF: TEXAS INSTRUMENTS; MPN: SN74AHC05N; OC_FARNELL: 1749925
IC5 IC7 IC9 IC11 IC13 = dec-con:74*38: Quad 2-input NAND gate, open collector output; MF: TEXAS INSTRUMENTS; MPN: SN7438N; OC_FARNELL: 1607804
JP1 = pinhead:PINHD-1X6: PIN HEADER; MF: MULTICOMP; MPN: MC34751; OC_FARNELL: 1593430
JP2-JP20 P_GND = pinhead:PINHD-1X1: PIN HEADER; OC_FARNELL: unknown
L100 R1-R4 = rcl:R-EU_: RESISTOR, European symbol; OC_FARNELL: unknown
LED1 LED3 = led:LED: LED OSRAM: - CHIPLED LG R971, LG N971, LY N971, LG Q971, LY Q971, LO R971, LY R971 LH N974, LH R974 LS Q976, LO Q976, LY Q976 LO Q996 - Hyper CHIPLED LW Q18S LB Q993, LB Q99A, LB R99A - SideLED LS A670, LO A670, LY A670, LG A670, LP A670 LB A673, LV A673, LT A673, LW A673 LH A674 LY A675 LS A676, LA A676, LO A676, LY A676, LW A676 LS A679, LY A679, LG A679 - Hyper Micro SIDELED® LS Y876, LA Y876, LO Y876, LY Y876 LT Y87S - SmartLED LW L88C, LW L88S LB L89C, LB L89S, LG L890 LS L89K, LO L89K, LY L89K LS L896, LA L896, LO L896, LY L896 - TOPLED LS T670, LO T670, LY T670, LG T670, LP T670 LSG T670, LSP T670, LSY T670, LOP T670, LYG T670 LG T671, LOG T671, LSG T671 LB T673, LV T673, LT T673, LW T673 LH T674 LS T676, LA T676, LO T676, LY T676, LB T676, LH T676, LSB T676, LW T676 LB T67C, LV T67C, LT T67C, LS T67K, LO T67K, LY T67K, LW E67C LS E67B, LA E67B, LO E67B, LY E67B, LB E67C, LV E67C, LT E67C LW T67C LS T679, LY T679, LG T679 LS T770, LO T770, LY T770, LG T770, LP T770 LB T773, LV T773, LT T773, LW T773 LH T774 LS E675, LA E675, LY E675, LS T675 LS T776, LA T776, LO T776, LY T776, LB T776 LHGB T686 LT T68C, LB T68C - Hyper Mini TOPLED® LB M676 - Mini TOPLED Santana® LG M470 LS M47K, LO M47K, LY M47K Source: http://www.osram.convergy.de LUXEON: - LUMILED® LXK2-PW12-R00, LXK2-PW12-S00, LXK2-PW14-U00, LXK2-PW14-V00 LXK2-PM12-R00, LXK2-PM12-S00, LXK2-PM14-U00 LXK2-PE12-Q00, LXK2-PE12-R00, LXK2-PE12-S00, LXK2-PE14-T00, LXK2-PE14-U00 LXK2-PB12-K00, LXK2-PB12-L00, LXK2-PB12-M00, LXK2-PB14-N00, LXK2-PB14-P00, LXK2-PB14-Q00 LXK2-PR12-L00, LXK2-PR12-M00, LXK2-PR14-Q00, LXK2-PR14-R00 LXK2-PD12-Q00, LXK2-PD12-R00, LXK2-PD12-S00 LXK2-PH12-R00, LXK2-PH12-S00 LXK2-PL12-P00, LXK2-PL12-Q00, LXK2-PL12-R00 Source: www.luxeon.com KINGBRIGHT: KA-3528ASYC Source: www.kingbright.com; MF: KINGBRIGHT; MPN: KP-2012SRC-PRV; OC_FARNELL: 1318244
LED2 LED4 = led:LED: LED OSRAM: - CHIPLED LG R971, LG N971, LY N971, LG Q971, LY Q971, LO R971, LY R971 LH N974, LH R974 LS Q976, LO Q976, LY Q976 LO Q996 - Hyper CHIPLED LW Q18S LB Q993, LB Q99A, LB R99A - SideLED LS A670, LO A670, LY A670, LG A670, LP A670 LB A673, LV A673, LT A673, LW A673 LH A674 LY A675 LS A676, LA A676, LO A676, LY A676, LW A676 LS A679, LY A679, LG A679 - Hyper Micro SIDELED® LS Y876, LA Y876, LO Y876, LY Y876 LT Y87S - SmartLED LW L88C, LW L88S LB L89C, LB L89S, LG L890 LS L89K, LO L89K, LY L89K LS L896, LA L896, LO L896, LY L896 - TOPLED LS T670, LO T670, LY T670, LG T670, LP T670 LSG T670, LSP T670, LSY T670, LOP T670, LYG T670 LG T671, LOG T671, LSG T671 LB T673, LV T673, LT T673, LW T673 LH T674 LS T676, LA T676, LO T676, LY T676, LB T676, LH T676, LSB T676, LW T676 LB T67C, LV T67C, LT T67C, LS T67K, LO T67K, LY T67K, LW E67C LS E67B, LA E67B, LO E67B, LY E67B, LB E67C, LV E67C, LT E67C LW T67C LS T679, LY T679, LG T679 LS T770, LO T770, LY T770, LG T770, LP T770 LB T773, LV T773, LT T773, LW T773 LH T774 LS E675, LA E675, LY E675, LS T675 LS T776, LA T776, LO T776, LY T776, LB T776 LHGB T686 LT T68C, LB T68C - Hyper Mini TOPLED® LB M676 - Mini TOPLED Santana® LG M470 LS M47K, LO M47K, LY M47K Source: http://www.osram.convergy.de LUXEON: - LUMILED® LXK2-PW12-R00, LXK2-PW12-S00, LXK2-PW14-U00, LXK2-PW14-V00 LXK2-PM12-R00, LXK2-PM12-S00, LXK2-PM14-U00 LXK2-PE12-Q00, LXK2-PE12-R00, LXK2-PE12-S00, LXK2-PE14-T00, LXK2-PE14-U00 LXK2-PB12-K00, LXK2-PB12-L00, LXK2-PB12-M00, LXK2-PB14-N00, LXK2-PB14-P00, LXK2-PB14-Q00 LXK2-PR12-L00, LXK2-PR12-M00, LXK2-PR14-Q00, LXK2-PR14-R00 LXK2-PD12-Q00, LXK2-PD12-R00, LXK2-PD12-S00 LXK2-PH12-R00, LXK2-PH12-S00 LXK2-PL12-P00, LXK2-PL12-Q00, LXK2-PL12-R00 Source: www.luxeon.com KINGBRIGHT: KA-3528ASYC Source: www.kingbright.com; MF: KINGBRIGHT; MPN: KPT-2012CGCK; OC_FARNELL: 2099235
R5-R40 = rcl:R-EU_: RESISTOR, European symbol; MF: PANASONIC; MPN: ERJ6GEYJ102V; OC_FARNELL: 2057701
R41-R52 = rcl:R-EU_: RESISTOR, European symbol; MF: PANASONIC; MPN: ERJ6GEYJ473V; OC_FARNELL: 2057728
R100 R101 = rcl:R-EU_: RESISTOR, European symbol; MF: PANASONIC; MPN: ERJ6ENF2742V; OC_FARNELL: 2057644
S1 S2 = switch-dil:DIP06YL: DIL/CODE SWITCH; OC_FARNELL: unknown; OC_NEWARK: unknown
U$1 = dec-con:OUTLINE-*: Board outlines for DEC boards.; OC_FARNELL: unknown
U$2 = dec-con:QUAD: Quad-Height DEC board; OC_FARNELL: unknown
USB_CONNECTOR = con-berg:PN61729-S: BERG USB connector; MF: MULTICOMP; MPN: MC32596; OC_FARNELL: 1696537; OC_NEWARK: unknown